# EAGLE schematic Main (EAGLE 8.0.2)
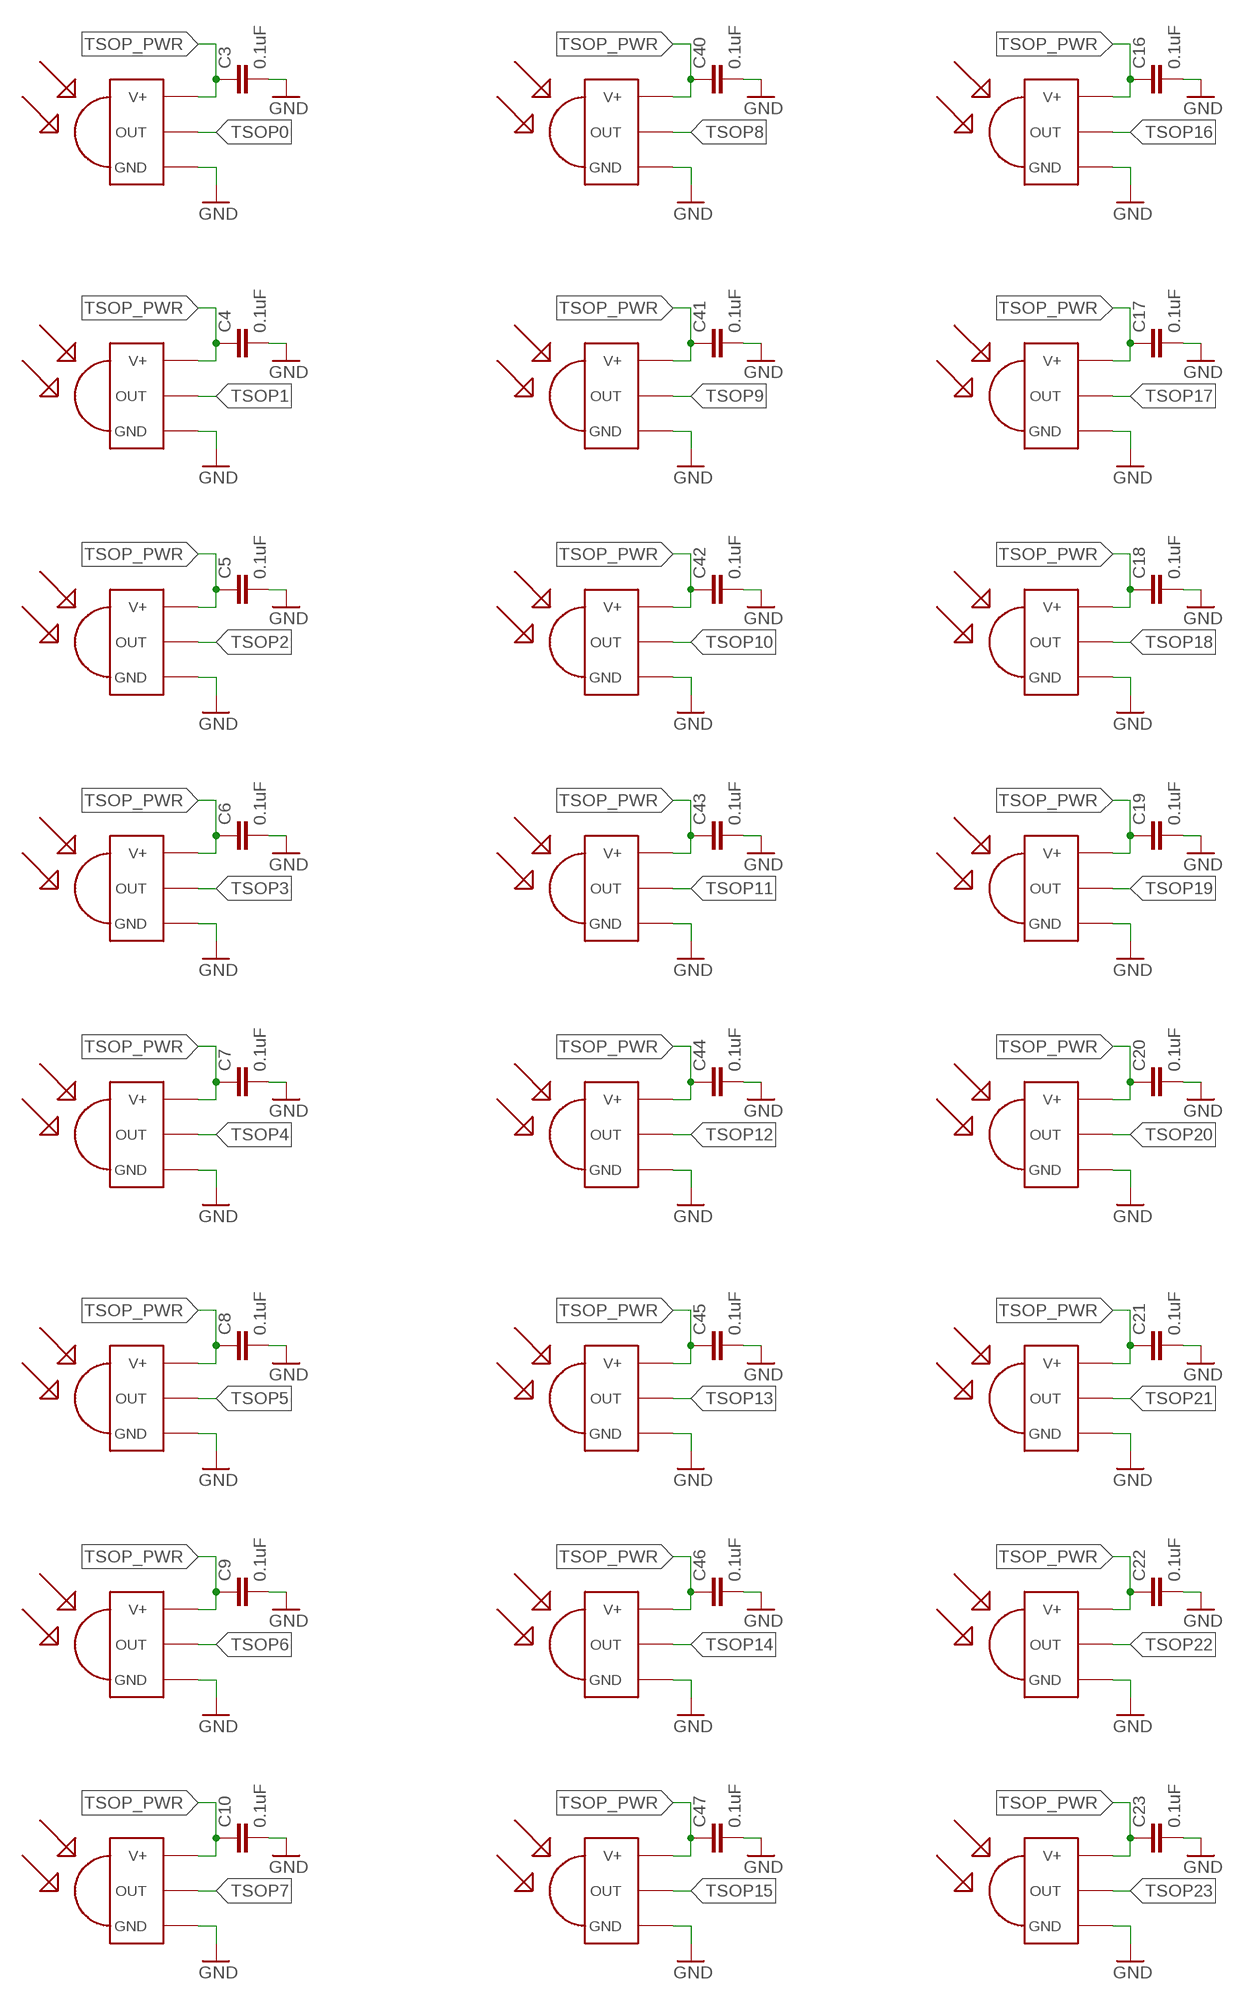
[diagram p0: schematic, sheet 1, part 1 of 3]
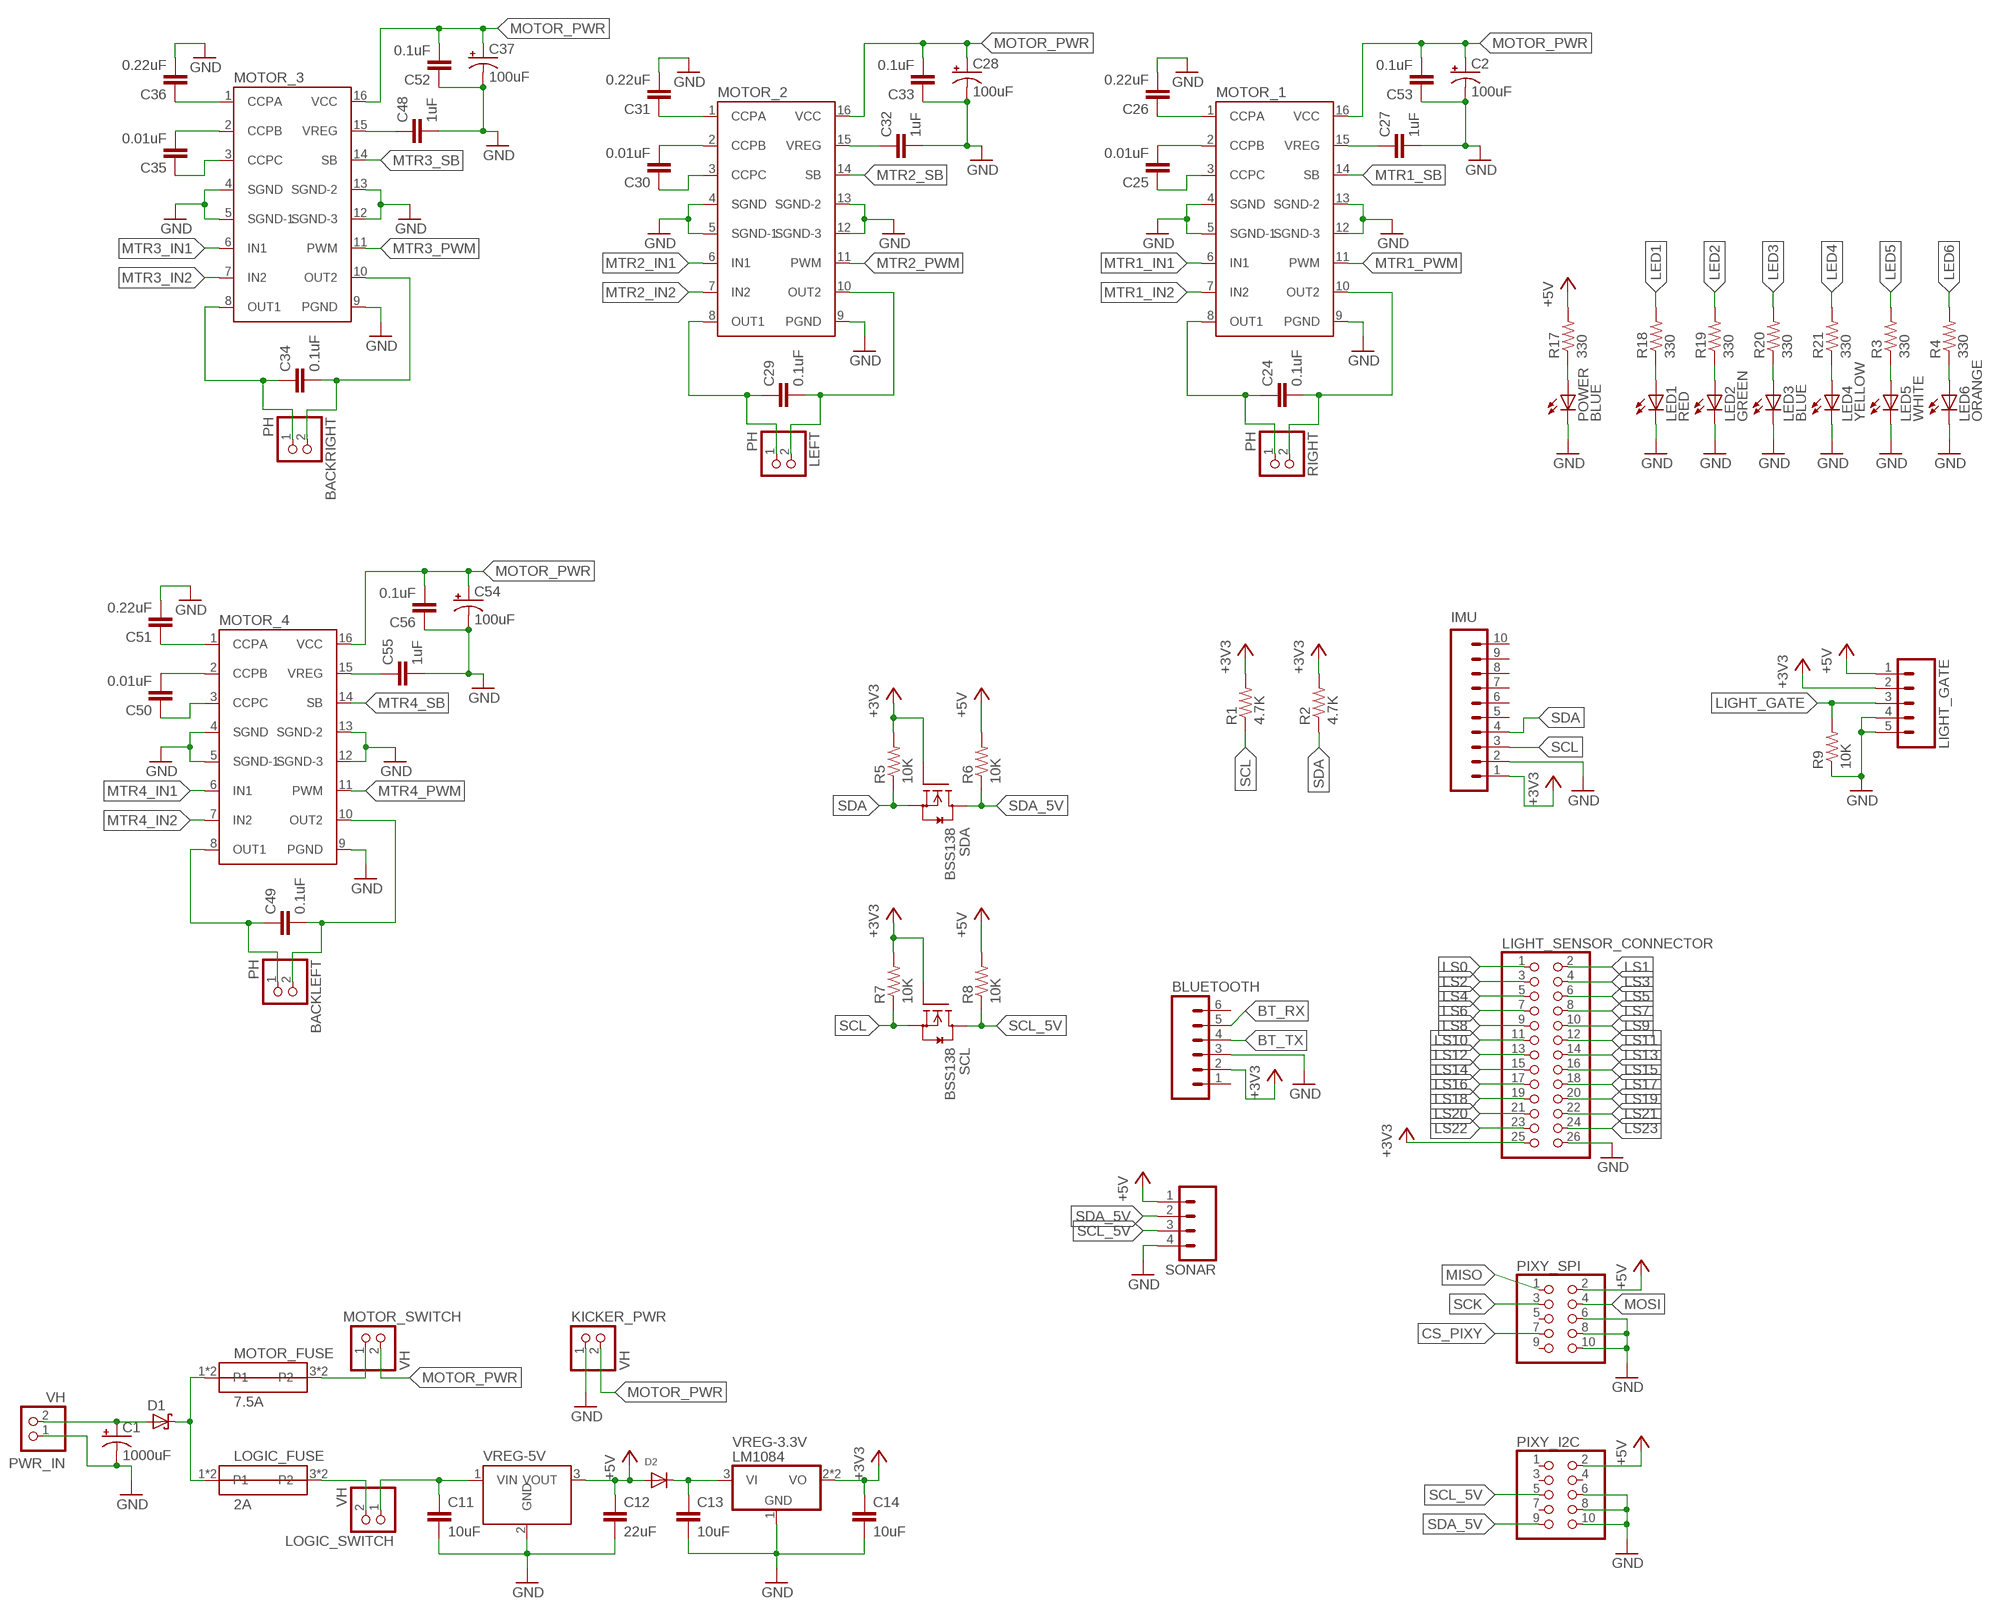
[diagram p1: schematic, sheet 1, part 2 of 3]
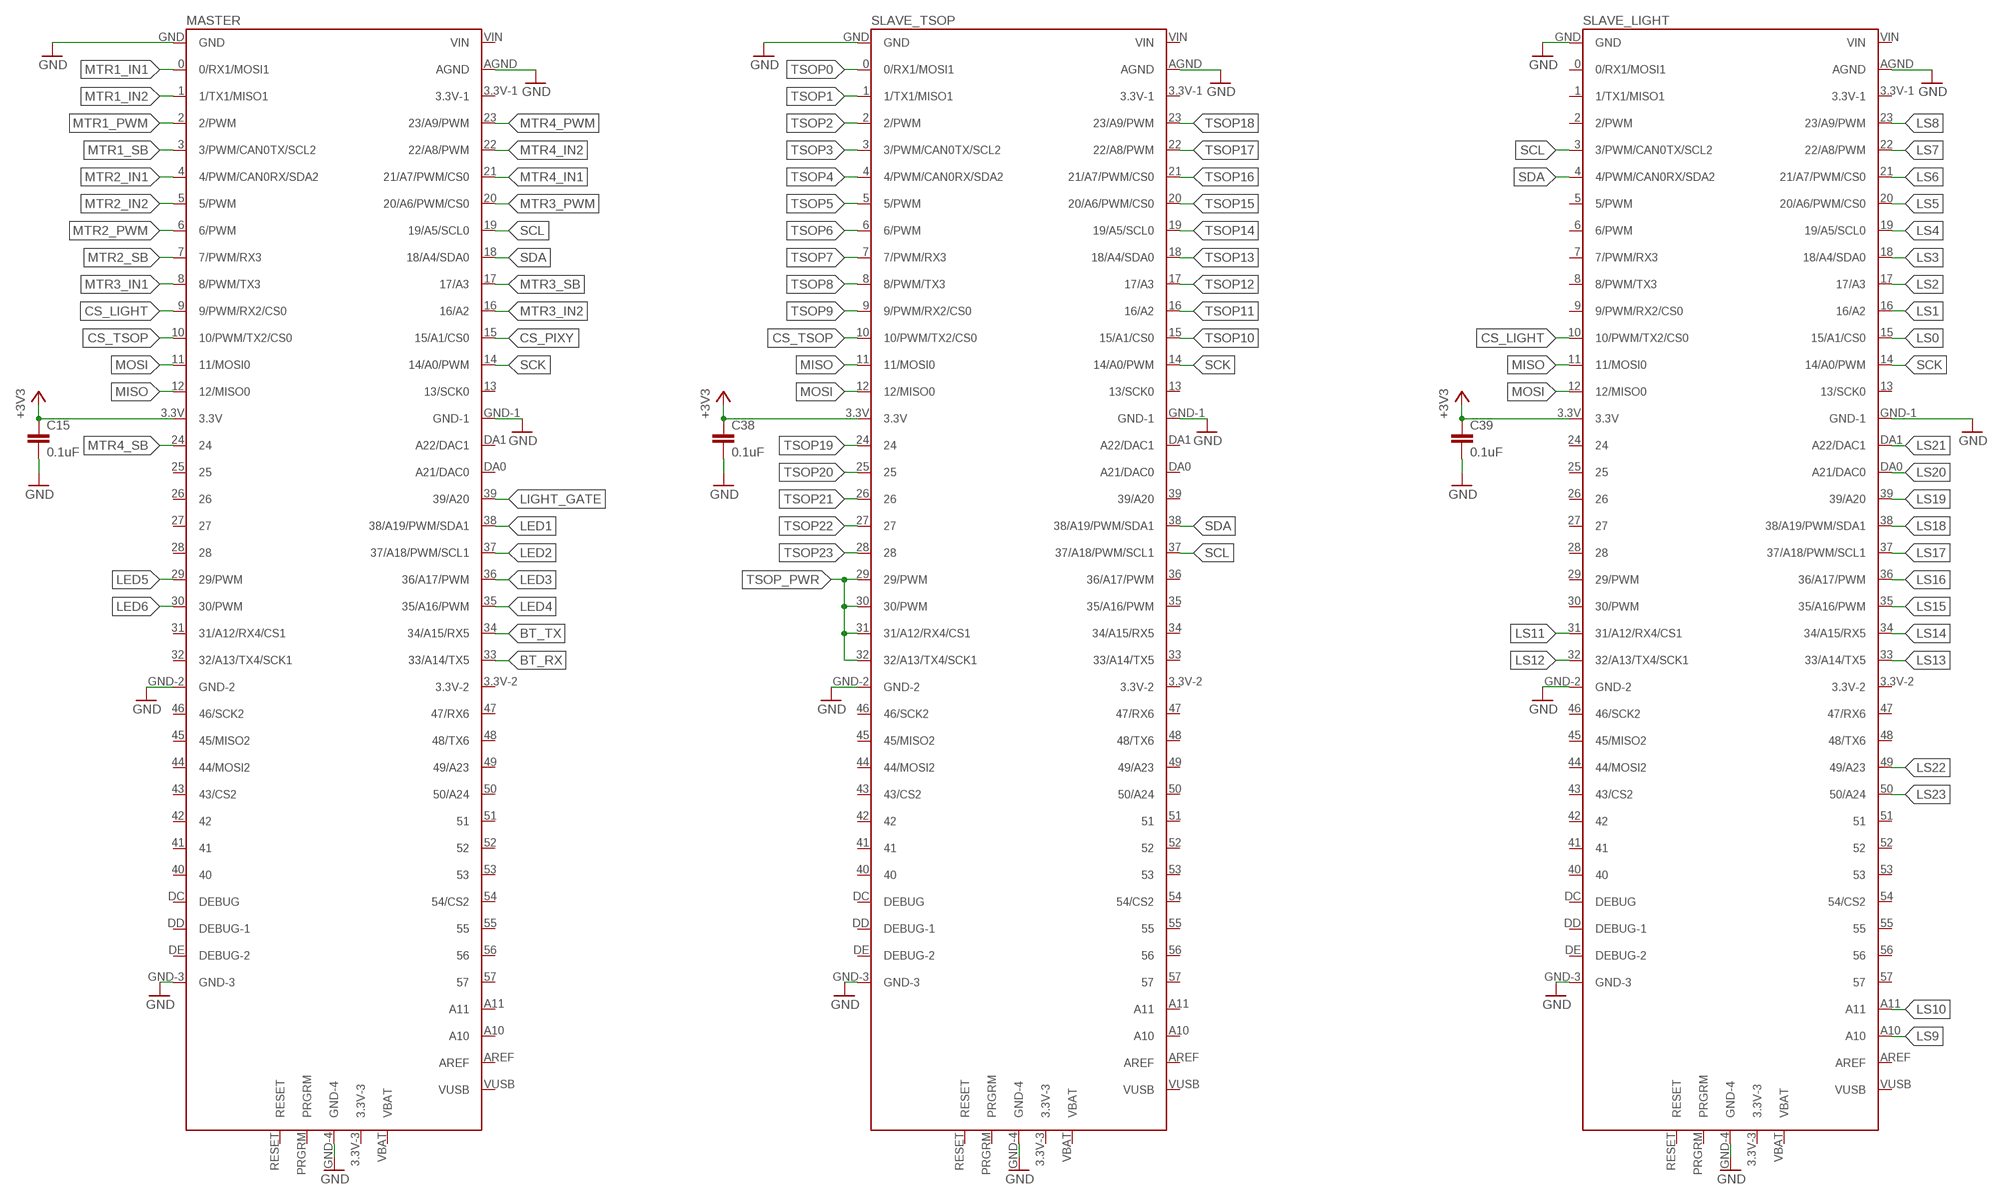
[diagram p2: schematic, sheet 1, part 3 of 3]

## Parts
0  TSOP1737  [TSOP17XX]
1  TSOP1737  [TSOP17XX]
2  TSOP1737  [TSOP17XX]
3  TSOP1737  [TSOP17XX]
4  TSOP1737  [TSOP17XX]
5  TSOP1737  [TSOP17XX]
6  TSOP1737  [TSOP17XX]
7  TSOP1737  [TSOP17XX]
8  TSOP1737  [TSOP17XX]
9  TSOP1737  [TSOP17XX]
10  TSOP1737  [TSOP17XX]
11  TSOP1737  [TSOP17XX]
12  TSOP1737  [TSOP17XX]
13  TSOP1737  [TSOP17XX]
14  TSOP1737  [TSOP17XX]
15  TSOP1737  [TSOP17XX]
16  TSOP1737  [TSOP17XX]
17  TSOP1737  [TSOP17XX]
18  TSOP1737  [TSOP17XX]
19  TSOP1737  [TSOP17XX]
20  TSOP1737  [TSOP17XX]
21  TSOP1737  [TSOP17XX]
22  TSOP1737  [TSOP17XX]
23  TSOP1737  [TSOP17XX]
BACKLEFT  PH  JST_2PIN-THM  [JST-PH-2-THM]
BACKRIGHT  PH  JST_2PIN-THM  [JST-PH-2-THM]
BLUETOOTH  M06SILK_FEMALE_PTH  [1X06]
C1  1000uF  CAP_POLPTH4  [CPOL-RADIAL-1000UF-25V]
C2  100uF  CAP_POLPTH1  [CPOL-RADIAL-100UF-25V]
C3  0.1uF  CAP0603-CAP  [0603-CAP]
C4  0.1uF  CAP0603-CAP  [0603-CAP]
C5  0.1uF  CAP0603-CAP  [0603-CAP]
C6  0.1uF  CAP0603-CAP  [0603-CAP]
C7  0.1uF  CAP0603-CAP  [0603-CAP]
C8  0.1uF  CAP0603-CAP  [0603-CAP]
C9  0.1uF  CAP0603-CAP  [0603-CAP]
C10  0.1uF  CAP0603-CAP  [0603-CAP]
C11  10uF  CAP0805  [0805]
C12  22uF  CAP0805  [0805]
C13  10uF  CAP0805  [0805]
C14  10uF  CAP0805  [0805]
C15  0.1uF  CAP0603-CAP  [0603-CAP]
C16  0.1uF  CAP0603-CAP  [0603-CAP]
C17  0.1uF  CAP0603-CAP  [0603-CAP]
C18  0.1uF  CAP0603-CAP  [0603-CAP]
C19  0.1uF  CAP0603-CAP  [0603-CAP]
C20  0.1uF  CAP0603-CAP  [0603-CAP]
C21  0.1uF  CAP0603-CAP  [0603-CAP]
C22  0.1uF  CAP0603-CAP  [0603-CAP]
C23  0.1uF  CAP0603-CAP  [0603-CAP]
C24  0.1uF  CAP0603-CAP  [0603-CAP]
C25  0.01uF  CAP0603-CAP  [0603-CAP]
C26  0.22uF  CAP0603-CAP  [0603-CAP]
C27  1uF  CAP0603-CAP  [0603-CAP]
C28  100uF  CAP_POLPTH1  [CPOL-RADIAL-100UF-25V]
C29  0.1uF  CAP0603-CAP  [0603-CAP]
C30  0.01uF  CAP0603-CAP  [0603-CAP]
C31  0.22uF  CAP0603-CAP  [0603-CAP]
C32  1uF  CAP0603-CAP  [0603-CAP]
C33  0.1uF  CAP0603-CAP  [0603-CAP]
C34  0.1uF  CAP0603-CAP  [0603-CAP]
C35  0.01uF  CAP0603-CAP  [0603-CAP]
C36  0.22uF  CAP0603-CAP  [0603-CAP]
C37  100uF  CAP_POLPTH1  [CPOL-RADIAL-100UF-25V]
C38  0.1uF  CAP0603-CAP  [0603-CAP]
C39  0.1uF  CAP0603-CAP  [0603-CAP]
C40  0.1uF  CAP0603-CAP  [0603-CAP]
C41  0.1uF  CAP0603-CAP  [0603-CAP]
C42  0.1uF  CAP0603-CAP  [0603-CAP]
C43  0.1uF  CAP0603-CAP  [0603-CAP]
C44  0.1uF  CAP0603-CAP  [0603-CAP]
C45  0.1uF  CAP0603-CAP  [0603-CAP]
C46  0.1uF  CAP0603-CAP  [0603-CAP]
C47  0.1uF  CAP0603-CAP  [0603-CAP]
C48  1uF  CAP0603-CAP  [0603-CAP]
C49  0.1uF  CAP0603-CAP  [0603-CAP]
C50  0.01uF  CAP0603-CAP  [0603-CAP]
C51  0.22uF  CAP0603-CAP  [0603-CAP]
C52  0.1uF  CAP0603-CAP  [0603-CAP]
C53  0.1uF  CAP0603-CAP  [0603-CAP]
C54  100uF  CAP_POLPTH1  [CPOL-RADIAL-100UF-25V]
C55  1uF  CAP0603-CAP  [0603-CAP]
C56  0.1uF  CAP0603-CAP  [0603-CAP]
D1  SCHOTTKY-DIODEP6T15  [P6T15]
D2  DIODE_SOD-123FL  [SOD-123FL]
IMU  M10SILK_FEMALE_PTH  [1X10]
KICKER_PWR  VH  B2P-VH  [B2P-VH]
LED1  RED  LEDCHIPLED_0603  [CHIPLED_0603]
LED2  GREEN  LEDCHIPLED_0603  [CHIPLED_0603]
LED3  BLUE  LEDCHIPLED_0603  [CHIPLED_0603]
LED4  YELLOW  LEDCHIPLED_0603  [CHIPLED_0603]
LED5  WHITE  LEDCHIPLED_0603  [CHIPLED_0603]
LED6  ORANGE  LEDCHIPLED_0603  [CHIPLED_0603]
LEFT  PH  JST_2PIN-THM  [JST-PH-2-THM]
LIGHT_GATE  M05PTH  [1X05]
LIGHT_SENSOR_CONNECTOR  PINHD-2X13SMT  [2X13_SMT]
LOGIC_FUSE  2A  3568-FUSEHOLDER  [3568-FUSEHOLDER]
LOGIC_SWITCH  VH  B2P-VH  [B2P-VH]
MASTER  TEENSY-3.5  [TEENSY-3.5]
MOTOR_1  TB6549PG  [TB6549PG]
MOTOR_2  TB6549PG  [TB6549PG]
MOTOR_3  TB6549PG  [TB6549PG]
MOTOR_4  TB6549PG  [TB6549PG]
MOTOR_FUSE  7.5A  3568-FUSEHOLDER  [3568-FUSEHOLDER]
MOTOR_SWITCH  VH  B2P-VH  [B2P-VH]
PIXY_I2C  PINHD-2X5SMT  [2X05_SMT]
PIXY_SPI  PINHD-2X5SMT  [2X05_SMT]
POWER  BLUE  LEDCHIPLED_0603  [CHIPLED_0603]
PWR_IN  VH  B2P-VH  [B2P-VH]
R1  4.7K  RESISTOR0603  [0603-RES]
R2  4.7K  RESISTOR0603  [0603-RES]
R3  330  RESISTOR0603  [0603-RES]
R4  330  RESISTOR0603  [0603-RES]
R5  10K  RESISTOR0603-RES  [0603-RES]
R6  10K  RESISTOR0603-RES  [0603-RES]
R7  10K  RESISTOR0603-RES  [0603-RES]
R8  10K  RESISTOR0603-RES  [0603-RES]
R9  10K  RESISTOR0603-RES  [0603-RES]
R17  330  RESISTOR0603  [0603-RES]
R18  330  RESISTOR0603  [0603-RES]
R19  330  RESISTOR0603  [0603-RES]
R20  330  RESISTOR0603  [0603-RES]
R21  330  RESISTOR0603  [0603-RES]
RIGHT  PH  JST_2PIN-THM  [JST-PH-2-THM]
SCL  BSS138  [SOT23]
SDA  BSS138  [SOT23]
SLAVE_LIGHT  TEENSY-3.5  [TEENSY-3.5]
SLAVE_TSOP  TEENSY-3.5  [TEENSY-3.5]
SONAR  M04PTH  [1X04]
VREG-3.3V  LM1084  LM340S-05  [TO263-3]
VREG-5V  V78-2000  [V78-2000]

## Nets
+3V3: BLUETOOTH.2 C14.1 C15.1 C38.1 C39.1 IMU.1 LIGHT_GATE.2 LIGHT_SENSOR_CONNECTOR.25 MASTER.3.3V R1.2 R2.2 R5.2 R7.2 SCL.1(G) SDA.1(G) SLAVE_LIGHT.3.3V SLAVE_TSOP.3.3V VREG-3.3V.2(VO) VREG-3.3V.TAB(VO)
+5V: C12.1 D2.A LIGHT_GATE.1 PIXY_I2C.2 PIXY_SPI.2 R6.2 R8.2 R17.2 SONAR.1 VREG-5V.3(VOUT)
BT_RX: BLUETOOTH.5 MASTER.33(33/A14/TX5)
BT_TX: BLUETOOTH.4 MASTER.34(34/A15/RX5)
CS_LIGHT: MASTER.9(9/PWM/RX2/CS0) SLAVE_LIGHT.10(10/PWM/TX2/CS0)
CS_PIXY: MASTER.15(15/A1/CS0) PIXY_SPI.7
CS_TSOP: MASTER.10(10/PWM/TX2/CS0) SLAVE_TSOP.10(10/PWM/TX2/CS0)
GND: 0.GND 1.GND 2.GND 3.GND 4.GND 5.GND 6.GND 7.GND 8.GND 9.GND 10.GND 11.GND 12.GND 13.GND 14.GND 15.GND 16.GND 17.GND 18.GND 19.GND 20.GND 21.GND 22.GND 23.GND BLUETOOTH.3 C1.- C2.2(-) C3.2 C4.2 C5.2 C6.2 C7.2 C8.2 C9.2 C10.2 C11.2 C12.2 C13.2 C14.2 C15.2 C16.2 C17.2 C18.2 C19.2 C20.2 C21.2 C22.2 C23.2 C26.2 C27.2 C28.2(-) C31.2 C32.2 C33.1 C36.2 C37.2(-) C38.2 C39.2 C40.2 C41.2 C42.2 C43.2 C44.2 C45.2 C46.2 C47.2 C48.2 C51.2 C52.1 C53.1 C54.2(-) C55.2 C56.1 IMU.2 KICKER_PWR.1 LED1.C LED2.C LED3.C LED4.C LED5.C LED6.C LIGHT_GATE.4 LIGHT_GATE.5 LIGHT_SENSOR_CONNECTOR.26 MASTER.AGND MASTER.GND MASTER.GND-1 MASTER.GND-2 MASTER.GND-3 MASTER.GND-4 MOTOR_1.4(SGND) MOTOR_1.5(SGND-1) MOTOR_1.9(PGND) MOTOR_1.12(SGND-3) MOTOR_1.13(SGND-2) MOTOR_2.4(SGND) MOTOR_2.5(SGND-1) MOTOR_2.9(PGND) MOTOR_2.12(SGND-3) MOTOR_2.13(SGND-2) MOTOR_3.4(SGND) MOTOR_3.5(SGND-1) MOTOR_3.9(PGND) MOTOR_3.12(SGND-3) MOTOR_3.13(SGND-2) MOTOR_4.4(SGND) MOTOR_4.5(SGND-1) MOTOR_4.9(PGND) MOTOR_4.12(SGND-3) MOTOR_4.13(SGND-2) PIXY_I2C.6 PIXY_I2C.8 PIXY_I2C.10 PIXY_SPI.6 PIXY_SPI.8 PIXY_SPI.10 POWER.C PWR_IN.1 R9.1 SLAVE_LIGHT.AGND SLAVE_LIGHT.GND SLAVE_LIGHT.GND-1 SLAVE_LIGHT.GND-2 SLAVE_LIGHT.GND-3 SLAVE_LIGHT.GND-4 SLAVE_TSOP.AGND SLAVE_TSOP.GND SLAVE_TSOP.GND-1 SLAVE_TSOP.GND-2 SLAVE_TSOP.GND-3 SLAVE_TSOP.GND-4 SONAR.4 VREG-3.3V.1(GND) VREG-5V.2(GND)
LED1: MASTER.38(38/A19/PWM/SDA1) R18.2
LED2: MASTER.37(37/A18/PWM/SCL1) R19.2
LED3: MASTER.36(36/A17/PWM) R20.2
LED4: MASTER.35(35/A16/PWM) R21.2
LED5: MASTER.29(29/PWM) R3.2
LED6: MASTER.30(30/PWM) R4.2
LIGHT_GATE: LIGHT_GATE.3 MASTER.39(39/A20) R9.2
LS0: LIGHT_SENSOR_CONNECTOR.1 SLAVE_LIGHT.15(15/A1/CS0)
LS1: LIGHT_SENSOR_CONNECTOR.2 SLAVE_LIGHT.16(16/A2)
LS2: LIGHT_SENSOR_CONNECTOR.3 SLAVE_LIGHT.17(17/A3)
LS3: LIGHT_SENSOR_CONNECTOR.4 SLAVE_LIGHT.18(18/A4/SDA0)
LS4: LIGHT_SENSOR_CONNECTOR.5 SLAVE_LIGHT.19(19/A5/SCL0)
LS5: LIGHT_SENSOR_CONNECTOR.6 SLAVE_LIGHT.20(20/A6/PWM/CS0)
LS6: LIGHT_SENSOR_CONNECTOR.7 SLAVE_LIGHT.21(21/A7/PWM/CS0)
LS7: LIGHT_SENSOR_CONNECTOR.8 SLAVE_LIGHT.22(22/A8/PWM)
LS8: LIGHT_SENSOR_CONNECTOR.9 SLAVE_LIGHT.23(23/A9/PWM)
LS9: LIGHT_SENSOR_CONNECTOR.10 SLAVE_LIGHT.A10
LS10: LIGHT_SENSOR_CONNECTOR.11 SLAVE_LIGHT.A11
LS11: LIGHT_SENSOR_CONNECTOR.12 SLAVE_LIGHT.31(31/A12/RX4/CS1)
LS12: LIGHT_SENSOR_CONNECTOR.13 SLAVE_LIGHT.32(32/A13/TX4/SCK1)
LS13: LIGHT_SENSOR_CONNECTOR.14 SLAVE_LIGHT.33(33/A14/TX5)
LS14: LIGHT_SENSOR_CONNECTOR.15 SLAVE_LIGHT.34(34/A15/RX5)
LS15: LIGHT_SENSOR_CONNECTOR.16 SLAVE_LIGHT.35(35/A16/PWM)
LS16: LIGHT_SENSOR_CONNECTOR.17 SLAVE_LIGHT.36(36/A17/PWM)
LS17: LIGHT_SENSOR_CONNECTOR.18 SLAVE_LIGHT.37(37/A18/PWM/SCL1)
LS18: LIGHT_SENSOR_CONNECTOR.19 SLAVE_LIGHT.38(38/A19/PWM/SDA1)
LS19: LIGHT_SENSOR_CONNECTOR.20 SLAVE_LIGHT.39(39/A20)
LS20: LIGHT_SENSOR_CONNECTOR.21 SLAVE_LIGHT.DA0(A21/DAC0)
LS21: LIGHT_SENSOR_CONNECTOR.22 SLAVE_LIGHT.DA1(A22/DAC1)
LS22: LIGHT_SENSOR_CONNECTOR.23 SLAVE_LIGHT.49(49/A23)
LS23: LIGHT_SENSOR_CONNECTOR.24 SLAVE_LIGHT.50(50/A24)
MISO: MASTER.12(12/MISO0) PIXY_SPI.1 SLAVE_LIGHT.11(11/MOSI0) SLAVE_TSOP.11(11/MOSI0)
MOSI: MASTER.11(11/MOSI0) PIXY_SPI.4 SLAVE_LIGHT.12(12/MISO0) SLAVE_TSOP.12(12/MISO0)
MOTOR_PWR: C2.1(+) C28.1(+) C33.2 C37.1(+) C52.2 C53.2 C54.1(+) C56.2 KICKER_PWR.2 MOTOR_1.16(VCC) MOTOR_2.16(VCC) MOTOR_3.16(VCC) MOTOR_4.16(VCC) MOTOR_SWITCH.2
MTR1_IN1: MASTER.0(0/RX1/MOSI1) MOTOR_1.6(IN1)
MTR1_IN2: MASTER.1(1/TX1/MISO1) MOTOR_1.7(IN2)
MTR1_PWM: MASTER.2(2/PWM) MOTOR_1.11(PWM)
MTR1_SB: MASTER.3(3/PWM/CAN0TX/SCL2) MOTOR_1.14(SB)
MTR2_IN1: MASTER.4(4/PWM/CAN0RX/SDA2) MOTOR_2.6(IN1)
MTR2_IN2: MASTER.5(5/PWM) MOTOR_2.7(IN2)
MTR2_PWM: MASTER.6(6/PWM) MOTOR_2.11(PWM)
MTR2_SB: MASTER.7(7/PWM/RX3) MOTOR_2.14(SB)
MTR3_IN1: MASTER.8(8/PWM/TX3) MOTOR_3.6(IN1)
MTR3_IN2: MASTER.16(16/A2) MOTOR_3.7(IN2)
MTR3_PWM: MASTER.20(20/A6/PWM/CS0) MOTOR_3.11(PWM)
MTR3_SB: MASTER.17(17/A3) MOTOR_3.14(SB)
MTR4_IN1: MASTER.21(21/A7/PWM/CS0) MOTOR_4.6(IN1)
MTR4_IN2: MASTER.22(22/A8/PWM) MOTOR_4.7(IN2)
MTR4_PWM: MASTER.23(23/A9/PWM) MOTOR_4.11(PWM)
MTR4_SB: MASTER.24 MOTOR_4.14(SB)
N$1: C29.1 LEFT.1 MOTOR_2.8(OUT1)
N$2: C29.2 LEFT.2 MOTOR_2.10(OUT2)
N$3: C30.2 MOTOR_2.2(CCPB)
N$4: C30.1 MOTOR_2.3(CCPC)
N$5: C24.1 MOTOR_1.8(OUT1) RIGHT.1
N$6: C31.1 MOTOR_2.1(CCPA)
N$7: C24.2 MOTOR_1.10(OUT2) RIGHT.2
N$8: C48.1 MOTOR_3.15(VREG)
N$9: LOGIC_FUSE.3(P2) LOGIC_FUSE.4(P2) LOGIC_SWITCH.2
N$10: C25.2 MOTOR_1.2(CCPB)
N$11: C11.1 LOGIC_SWITCH.1 VREG-5V.1(VIN)
N$12: C25.1 MOTOR_1.3(CCPC)
N$13: C26.1 MOTOR_1.1(CCPA)
N$14: BACKRIGHT.1 C34.1 MOTOR_3.8(OUT1)
N$15: C27.1 MOTOR_1.15(VREG)
N$16: BACKRIGHT.2 C34.2 MOTOR_3.10(OUT2)
N$17: C35.2 MOTOR_3.2(CCPB)
N$18: C35.1 MOTOR_3.3(CCPC)
N$19: C36.1 MOTOR_3.1(CCPA)
N$20: C55.1 MOTOR_4.15(VREG)
N$21: MOTOR_FUSE.3(P2) MOTOR_FUSE.4(P2) MOTOR_SWITCH.1
N$22: BACKLEFT.1 C49.1 MOTOR_4.8(OUT1)
N$23: LED2.A R19.1
N$24: LED3.A R20.1
N$25: LED4.A R21.1
N$26: BACKLEFT.2 C49.2 MOTOR_4.10(OUT2)
N$27: POWER.A R17.1
N$28: C50.2 MOTOR_4.2(CCPB)
N$29: LED1.A R18.1
N$30: C50.1 MOTOR_4.3(CCPC)
N$31: C51.1 MOTOR_4.1(CCPA)
N$32: C32.1 MOTOR_2.15(VREG)
N$33: LED5.A R3.1
N$34: LED6.A R4.1
N$35: C1.+ D1.A PWR_IN.2
N$36: C13.1 D2.C VREG-3.3V.3(VI)
PWR: D1.C LOGIC_FUSE.1 LOGIC_FUSE.2(P1) MOTOR_FUSE.1 MOTOR_FUSE.2(P1)
SCK: MASTER.14(14/A0/PWM) PIXY_SPI.3 SLAVE_LIGHT.14(14/A0/PWM) SLAVE_TSOP.14(14/A0/PWM)
SCL: IMU.3 MASTER.19(19/A5/SCL0) R1.1 R7.1 SCL.2(S) SLAVE_LIGHT.3(3/PWM/CAN0TX/SCL2) SLAVE_TSOP.37(37/A18/PWM/SCL1)
SCL_5V: PIXY_I2C.5 R8.1 SCL.3(D) SONAR.3
SDA: IMU.4 MASTER.18(18/A4/SDA0) R2.1 R5.1 SDA.2(S) SLAVE_LIGHT.4(4/PWM/CAN0RX/SDA2) SLAVE_TSOP.38(38/A19/PWM/SDA1)
SDA_5V: PIXY_I2C.9 R6.1 SDA.3(D) SONAR.2
TSOP0: 0.OUT SLAVE_TSOP.0(0/RX1/MOSI1)
TSOP1: 1.OUT SLAVE_TSOP.1(1/TX1/MISO1)
TSOP2: 2.OUT SLAVE_TSOP.2(2/PWM)
TSOP3: 3.OUT SLAVE_TSOP.3(3/PWM/CAN0TX/SCL2)
TSOP4: 4.OUT SLAVE_TSOP.4(4/PWM/CAN0RX/SDA2)
TSOP5: 5.OUT SLAVE_TSOP.5(5/PWM)
TSOP6: 6.OUT SLAVE_TSOP.6(6/PWM)
TSOP7: 7.OUT SLAVE_TSOP.7(7/PWM/RX3)
TSOP8: 8.OUT SLAVE_TSOP.8(8/PWM/TX3)
TSOP9: 9.OUT SLAVE_TSOP.9(9/PWM/RX2/CS0)
TSOP10: 10.OUT SLAVE_TSOP.15(15/A1/CS0)
TSOP11: 11.OUT SLAVE_TSOP.16(16/A2)
TSOP12: 12.OUT SLAVE_TSOP.17(17/A3)
TSOP13: 13.OUT SLAVE_TSOP.18(18/A4/SDA0)
TSOP14: 14.OUT SLAVE_TSOP.19(19/A5/SCL0)
TSOP15: 15.OUT SLAVE_TSOP.20(20/A6/PWM/CS0)
TSOP16: 16.OUT SLAVE_TSOP.21(21/A7/PWM/CS0)
TSOP17: 17.OUT SLAVE_TSOP.22(22/A8/PWM)
TSOP18: 18.OUT SLAVE_TSOP.23(23/A9/PWM)
TSOP19: 19.OUT SLAVE_TSOP.24
TSOP20: 20.OUT SLAVE_TSOP.25
TSOP21: 21.OUT SLAVE_TSOP.26
TSOP22: 22.OUT SLAVE_TSOP.27
TSOP23: 23.OUT SLAVE_TSOP.28
TSOP_PWR: 0.V+ 1.V+ 2.V+ 3.V+ 4.V+ 5.V+ 6.V+ 7.V+ 8.V+ 9.V+ 10.V+ 11.V+ 12.V+ 13.V+ 14.V+ 15.V+ 16.V+ 17.V+ 18.V+ 19.V+ 20.V+ 21.V+ 22.V+ 23.V+ C3.1 C4.1 C5.1 C6.1 C7.1 C8.1 C9.1 C10.1 C16.1 C17.1 C18.1 C19.1 C20.1 C21.1 C22.1 C23.1 C40.1 C41.1 C42.1 C43.1 C44.1 C45.1 C46.1 C47.1 SLAVE_TSOP.29(29/PWM) SLAVE_TSOP.30(30/PWM) SLAVE_TSOP.31(31/A12/RX4/CS1) SLAVE_TSOP.32(32/A13/TX4/SCK1)
Unconnected: BLUETOOTH.1 BLUETOOTH.6 IMU.5 IMU.6 IMU.7 IMU.8 IMU.9 IMU.10 MASTER.3.3V-1 MASTER.3.3V-2 MASTER.3.3V-3 MASTER.13(13/SCK0) MASTER.25 MASTER.26 MASTER.27 MASTER.28 MASTER.31(31/A12/RX4/CS1) MASTER.32(32/A13/TX4/SCK1) MASTER.40 MASTER.41 MASTER.42 MASTER.43(43/CS2) MASTER.44(44/MOSI2) MASTER.45(45/MISO2) MASTER.46(46/SCK2) MASTER.47(47/RX6) MASTER.48(48/TX6) MASTER.49(49/A23) MASTER.50(50/A24) MASTER.51 MASTER.52 MASTER.53 MASTER.54(54/CS2) MASTER.55 MASTER.56 MASTER.57 MASTER.A10 MASTER.A11 MASTER.AREF MASTER.DA0(A21/DAC0) MASTER.DA1(A22/DAC1) MASTER.DC(DEBUG) MASTER.DD(DEBUG-1) MASTER.DE(DEBUG-2) MASTER.PRGRM MASTER.RESET MASTER.VBAT MASTER.VIN MASTER.VUSB PIXY_I2C.1 PIXY_I2C.3 PIXY_I2C.4 PIXY_I2C.7 PIXY_SPI.5 PIXY_SPI.9 SLAVE_LIGHT.0(0/RX1/MOSI1) SLAVE_LIGHT.1(1/TX1/MISO1) SLAVE_LIGHT.2(2/PWM) SLAVE_LIGHT.3.3V-1 SLAVE_LIGHT.3.3V-2 SLAVE_LIGHT.3.3V-3 SLAVE_LIGHT.5(5/PWM) SLAVE_LIGHT.6(6/PWM) SLAVE_LIGHT.7(7/PWM/RX3) SLAVE_LIGHT.8(8/PWM/TX3) SLAVE_LIGHT.9(9/PWM/RX2/CS0) SLAVE_LIGHT.13(13/SCK0) SLAVE_LIGHT.24 SLAVE_LIGHT.25 SLAVE_LIGHT.26 SLAVE_LIGHT.27 SLAVE_LIGHT.28 SLAVE_LIGHT.29(29/PWM) SLAVE_LIGHT.30(30/PWM) SLAVE_LIGHT.40 SLAVE_LIGHT.41 SLAVE_LIGHT.42 SLAVE_LIGHT.43(43/CS2) SLAVE_LIGHT.44(44/MOSI2) SLAVE_LIGHT.45(45/MISO2) SLAVE_LIGHT.46(46/SCK2) SLAVE_LIGHT.47(47/RX6) SLAVE_LIGHT.48(48/TX6) SLAVE_LIGHT.51 SLAVE_LIGHT.52 SLAVE_LIGHT.53 SLAVE_LIGHT.54(54/CS2) SLAVE_LIGHT.55 SLAVE_LIGHT.56 SLAVE_LIGHT.57 SLAVE_LIGHT.AREF SLAVE_LIGHT.DC(DEBUG) SLAVE_LIGHT.DD(DEBUG-1) SLAVE_LIGHT.DE(DEBUG-2) SLAVE_LIGHT.PRGRM SLAVE_LIGHT.RESET SLAVE_LIGHT.VBAT SLAVE_LIGHT.VIN SLAVE_LIGHT.VUSB SLAVE_TSOP.3.3V-1 SLAVE_TSOP.3.3V-2 SLAVE_TSOP.3.3V-3 SLAVE_TSOP.13(13/SCK0) SLAVE_TSOP.33(33/A14/TX5) SLAVE_TSOP.34(34/A15/RX5) SLAVE_TSOP.35(35/A16/PWM) SLAVE_TSOP.36(36/A17/PWM) SLAVE_TSOP.39(39/A20) SLAVE_TSOP.40 SLAVE_TSOP.41 SLAVE_TSOP.42 SLAVE_TSOP.43(43/CS2) SLAVE_TSOP.44(44/MOSI2) SLAVE_TSOP.45(45/MISO2) SLAVE_TSOP.46(46/SCK2) SLAVE_TSOP.47(47/RX6) SLAVE_TSOP.48(48/TX6) SLAVE_TSOP.49(49/A23) SLAVE_TSOP.50(50/A24) SLAVE_TSOP.51 SLAVE_TSOP.52 SLAVE_TSOP.53 SLAVE_TSOP.54(54/CS2) SLAVE_TSOP.55 SLAVE_TSOP.56 SLAVE_TSOP.57 SLAVE_TSOP.A10 SLAVE_TSOP.A11 SLAVE_TSOP.AREF SLAVE_TSOP.DA0(A21/DAC0) SLAVE_TSOP.DA1(A22/DAC1) SLAVE_TSOP.DC(DEBUG) SLAVE_TSOP.DD(DEBUG-1) SLAVE_TSOP.DE(DEBUG-2) SLAVE_TSOP.PRGRM SLAVE_TSOP.RESET SLAVE_TSOP.VBAT SLAVE_TSOP.VIN SLAVE_TSOP.VUSB

## Library data of the parts
0 1-23 = tsop:TSOP1737: IR Receiver and Demodulator
BACKLEFT BACKRIGHT LEFT RIGHT = adafruit:JST_2PIN: JST 2-Pin Connectors of various flavors SMT-RA (S2B-PH-SM4) 4UConnector #17311 SMT (B2B-PH-SM4) THM-RA (S2B-PH) THM (B2B-PH)
BLUETOOTH = SparkFun-Connectors:M06: Header 6 Standard 6-pin 0.1" header. Use with straight break away headers (SKU : PRT-00116), right angle break away headers (PRT-00553), swiss pins (PRT-00743), machine pins (PRT-00117), and female headers (PRT-00115). Molex polarized connector foot print use with SKU : PRT-08094 with associated crimp pins and housings. NOTES ON THE VARIANTS LOCK and LOCK_LONGPADS... This footprint was designed to help hold the alignment of a through-hole component (i.e. 6-pin header) while soldering it into place. You may notice that each hole has been shifted either up or down by 0.005 of an inch from it's more standard position (which is a perfectly straight line). This slight alteration caused the pins (the squares in the middle) to touch the edges of the holes. Because they are alternating, it causes a "brace" to hold the component in place. 0.005 has proven to be the perfect amount of "off-center" position when using our standard breakaway headers. Although looks a little odd when you look at the bare footprint, once you have a header in there, the alteration is very hard to notice. Also,if you push a header all the way into place, it is covered up entirely on the bottom side. This idea of altering the position of holes to aid alignment will be further integrated into the Sparkfun Library for other footprints. It can help hold any component with 3 or more connection pins.; PROD_ID: CONN-08437
C1 C2 C28 C37 C54 = SparkFun-Capacitors:CAP_POL: Capacitor Polarized These are standard SMD and PTH capacitors. Normally 10uF, 47uF, and 100uF in electrolytic and tantalum varieties. Always verify the external diameter of the through hole cap, it varies with capacity, voltage, and manufacturer. The EIA devices should be standard.
C3-C27 C29-C36 C38-C53 C55 C56 = SparkFun-Capacitors:CAP: Capacitor Standard 0603 ceramic capacitor, and 0.1" leaded capacitor.
D1 = diode:SCHOTTKY-DIODE: Schottky Diode
D2 = adafruit:DIODE: Diode SMADIODE - SMA Surface Mount Package 20V 1A Schottky Diode Digikey: 641-1014-6-ND DO-1N4148 - Through Hole Small Current Diode SOD-123 20V 1 A (.5mV Vf) Schottky Diode - Digikey: MBRX120TPMSCT-ND SOD-323 10V 570mA (.38mV Vf, 3ns) Schottky Diode - Digikey: ZLLS410CT-ND SOD-523 30V 30mA Schottky Diode (RB751S-40TE61) - Digikey: RB751S-40TE61CT-ND SOT23-R/W - SOT23 Package (R = Solder Paste/Reflow Ovens, W = Hand-Soldering) BAT54Film 40V 300mA - Digikey: 497-7162-1-ND
IMU = SparkFun-Connectors:M10: Header 10 Standard 10-pin 0.1" header. Use with straight break away headers (SKU : PRT-00116), right angle break away headers (PRT-00553), swiss pins (PRT-00743), machine pins (PRT-00117), and female headers (PRT-00115).; PROD_ID: CONN-11563
KICKER_PWR LOGIC_SWITCH MOTOR_SWITCH PWR_IN = jst-vh:B2P-VH: Wire-to-Board 3.96mm pitch top mount connector Source: http://www.jst-mfg.com/product/pdf/jpn/VH.pdf http://www.jst-mfg.com/product/detail.php?series=262
LED1-LED6 POWER = adafruit:LED: LED OSRAM: - CHIPLED LG R971, LG N971, LY N971, LG Q971, LY Q971, LO R971, LY R971 LH N974, LH R974 LS Q976, LO Q976, LY Q976 LO Q996 - Hyper CHIPLED LW Q18S LB Q993, LB Q99A, LB R99A - SideLED LS A670, LO A670, LY A670, LG A670, LP A670 LB A673, LV A673, LT A673, LW A673 LH A674 LY A675 LS A676, LA A676, LO A676, LY A676, LW A676 LS A679, LY A679, LG A679 - Hyper Micro SIDELED® LS Y876, LA Y876, LO Y876, LY Y876 LT Y87S - SmartLED LW L88C, LW L88S LB L89C, LB L89S, LG L890 LS L89K, LO L89K, LY L89K LS L896, LA L896, LO L896, LY L896 - TOPLED LS T670, LO T670, LY T670, LG T670, LP T670 LSG T670, LSP T670, LSY T670, LOP T670, LYG T670 LG T671, LOG T671, LSG T671 LB T673, LV T673, LT T673, LW T673 LH T674 LS T676, LA T676, LO T676, LY T676, LB T676, LH T676, LSB T676, LW T676 LB T67C, LV T67C, LT T67C, LS T67K, LO T67K, LY T67K, LW E67C LS E67B, LA E67B, LO E67B, LY E67B, LB E67C, LV E67C, LT E67C LW T67C LS T679, LY T679, LG T679 LS T770, LO T770, LY T770, LG T770, LP T770 LB T773, LV T773, LT T773, LW T773 LH T774 LS E675, LA E675, LY E675, LS T675 LS T776, LA T776, LO T776, LY T776, LB T776 LHGB T686 LT T68C, LB T68C - Hyper Mini TOPLED® LB M676 - Mini TOPLED Santana® LG M470 LS M47K, LO M47K, LY M47K Source: http://www.osram.convergy.de/
LIGHT_GATE = SparkFun-Connectors:M05: Header 5 Standard 5-pin 0.1" header. Use with straight break away headers (SKU : PRT-00116), right angle break away headers (PRT-00553), swiss pins (PRT-00743), machine pins (PRT-00117), and female headers (PRT-00115). Molex polarized connector foot print use with SKU : PRT-08230 with associated crimp pins and housings.
LIGHT_SENSOR_CONNECTOR = pinhead+:PINHD-2X13: PIN HEADER
LOGIC_FUSE MOTOR_FUSE = fuse-holder-3568:3568-FUSEHOLDER
MASTER SLAVE_LIGHT SLAVE_TSOP = teensy-3.5:TEENSY-3.5
MOTOR_1-MOTOR_4 = TB6549PG-motor-controller:TB6549PG
PIXY_I2C PIXY_SPI = pinhead+:PINHD-2X5: PIN HEADER
R1-R9 R17-R21 = SparkFun-Resistors:RESISTOR: Resistor Basic schematic elements and footprints for 0603, 1206, and PTH resistors.
SCL SDA = m-pad-2.1:BSS138: Fairchild Semiconductors BSS138 N-Channel Logic Level Enhancement Mode Field Effect Transistor General Description: These N-Channel enhancement mode field effect transistors are produced using Fairchild's proprietary, high cell density, DMOS technology. These products have been designed to minimize on-state resistance while provide rugged, reliable, and fast switching performance.These products are particularly suited for low voltage, low current applications such as small servo motor control, power MOSFET gate drivers, and other switching applications. Features: 0.22 A, 50 V. RDS(ON) = 3.5Ohm @ VGS = 10 V RDS(ON) = 6.0Ohm @ VGS = 4.5 V High density cell design for extremely low RDS(ON) Rugged and Reliable Compact industry standard SOT-23 surface mount package Please send any comments to: messi@users.sourceforge.net
SONAR = SparkFun-Connectors:M04: Header 4 Standard 4-pin 0.1" header. Use with straight break away headers (SKU : PRT-00116), right angle break away headers (PRT-00553), swiss pins (PRT-00743), machine pins (PRT-00117), and female headers (PRT-00115). Molex polarized connector foot print use with SKU : PRT-08231 with associated crimp pins and housings. 1MM SMD Version SKU: PRT-10208; PROD_ID: CONN-09696
VREG-3.3V = linear:LM340?-*: Positive VOLTAGE REGULATOR Source: http://cache.national.com/ds/LM/LM340.pdf
VREG-5V = V78-2000-switching-regulator:V78-2000